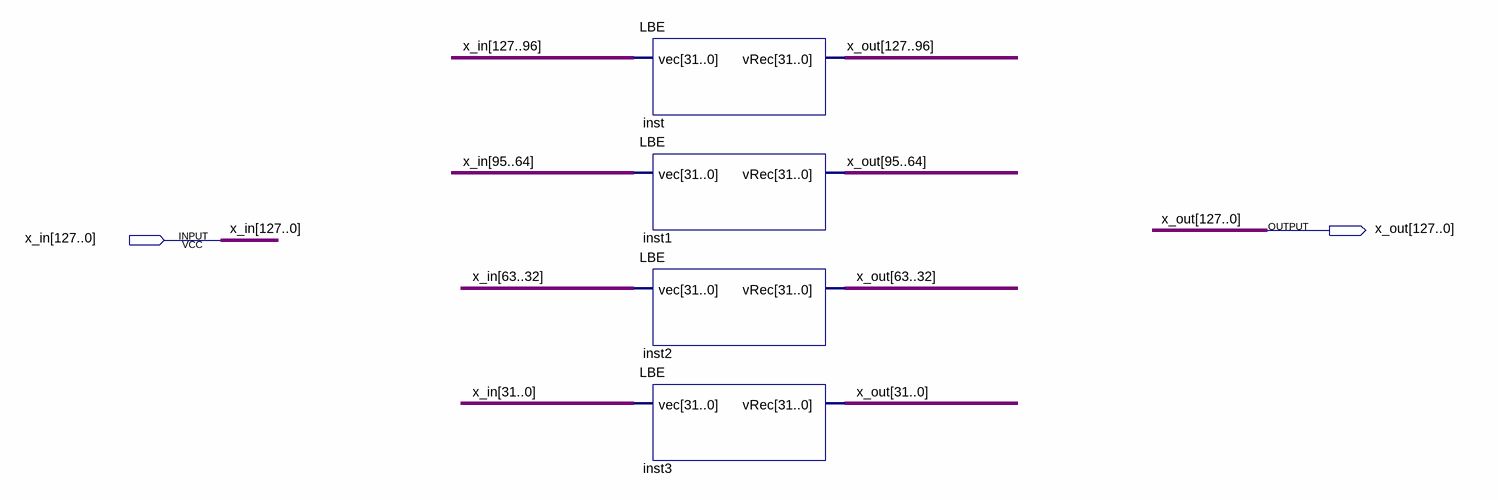
[diagram p0: schematic sheet]
// Quartus schematic LBE_short.bdf as structural Verilog: 4 symbols, 2 pins
module LBE_short (
  input  [127:0] x_in,
  output [127:0] x_out
);

  LBE inst (.vec(x_in[127:96]), .vRec(x_out[127:96]));
  LBE inst1 (.vec(x_in[95:64]), .vRec(x_out[95:64]));
  LBE inst2 (.vec(x_in[63:32]), .vRec(x_out[63:32]));
  LBE inst3 (.vec(x_in[31:0]), .vRec(x_out[31:0]));
endmodule
